# Altium schematic sheet 练习4原理图.SchDoc
size A3
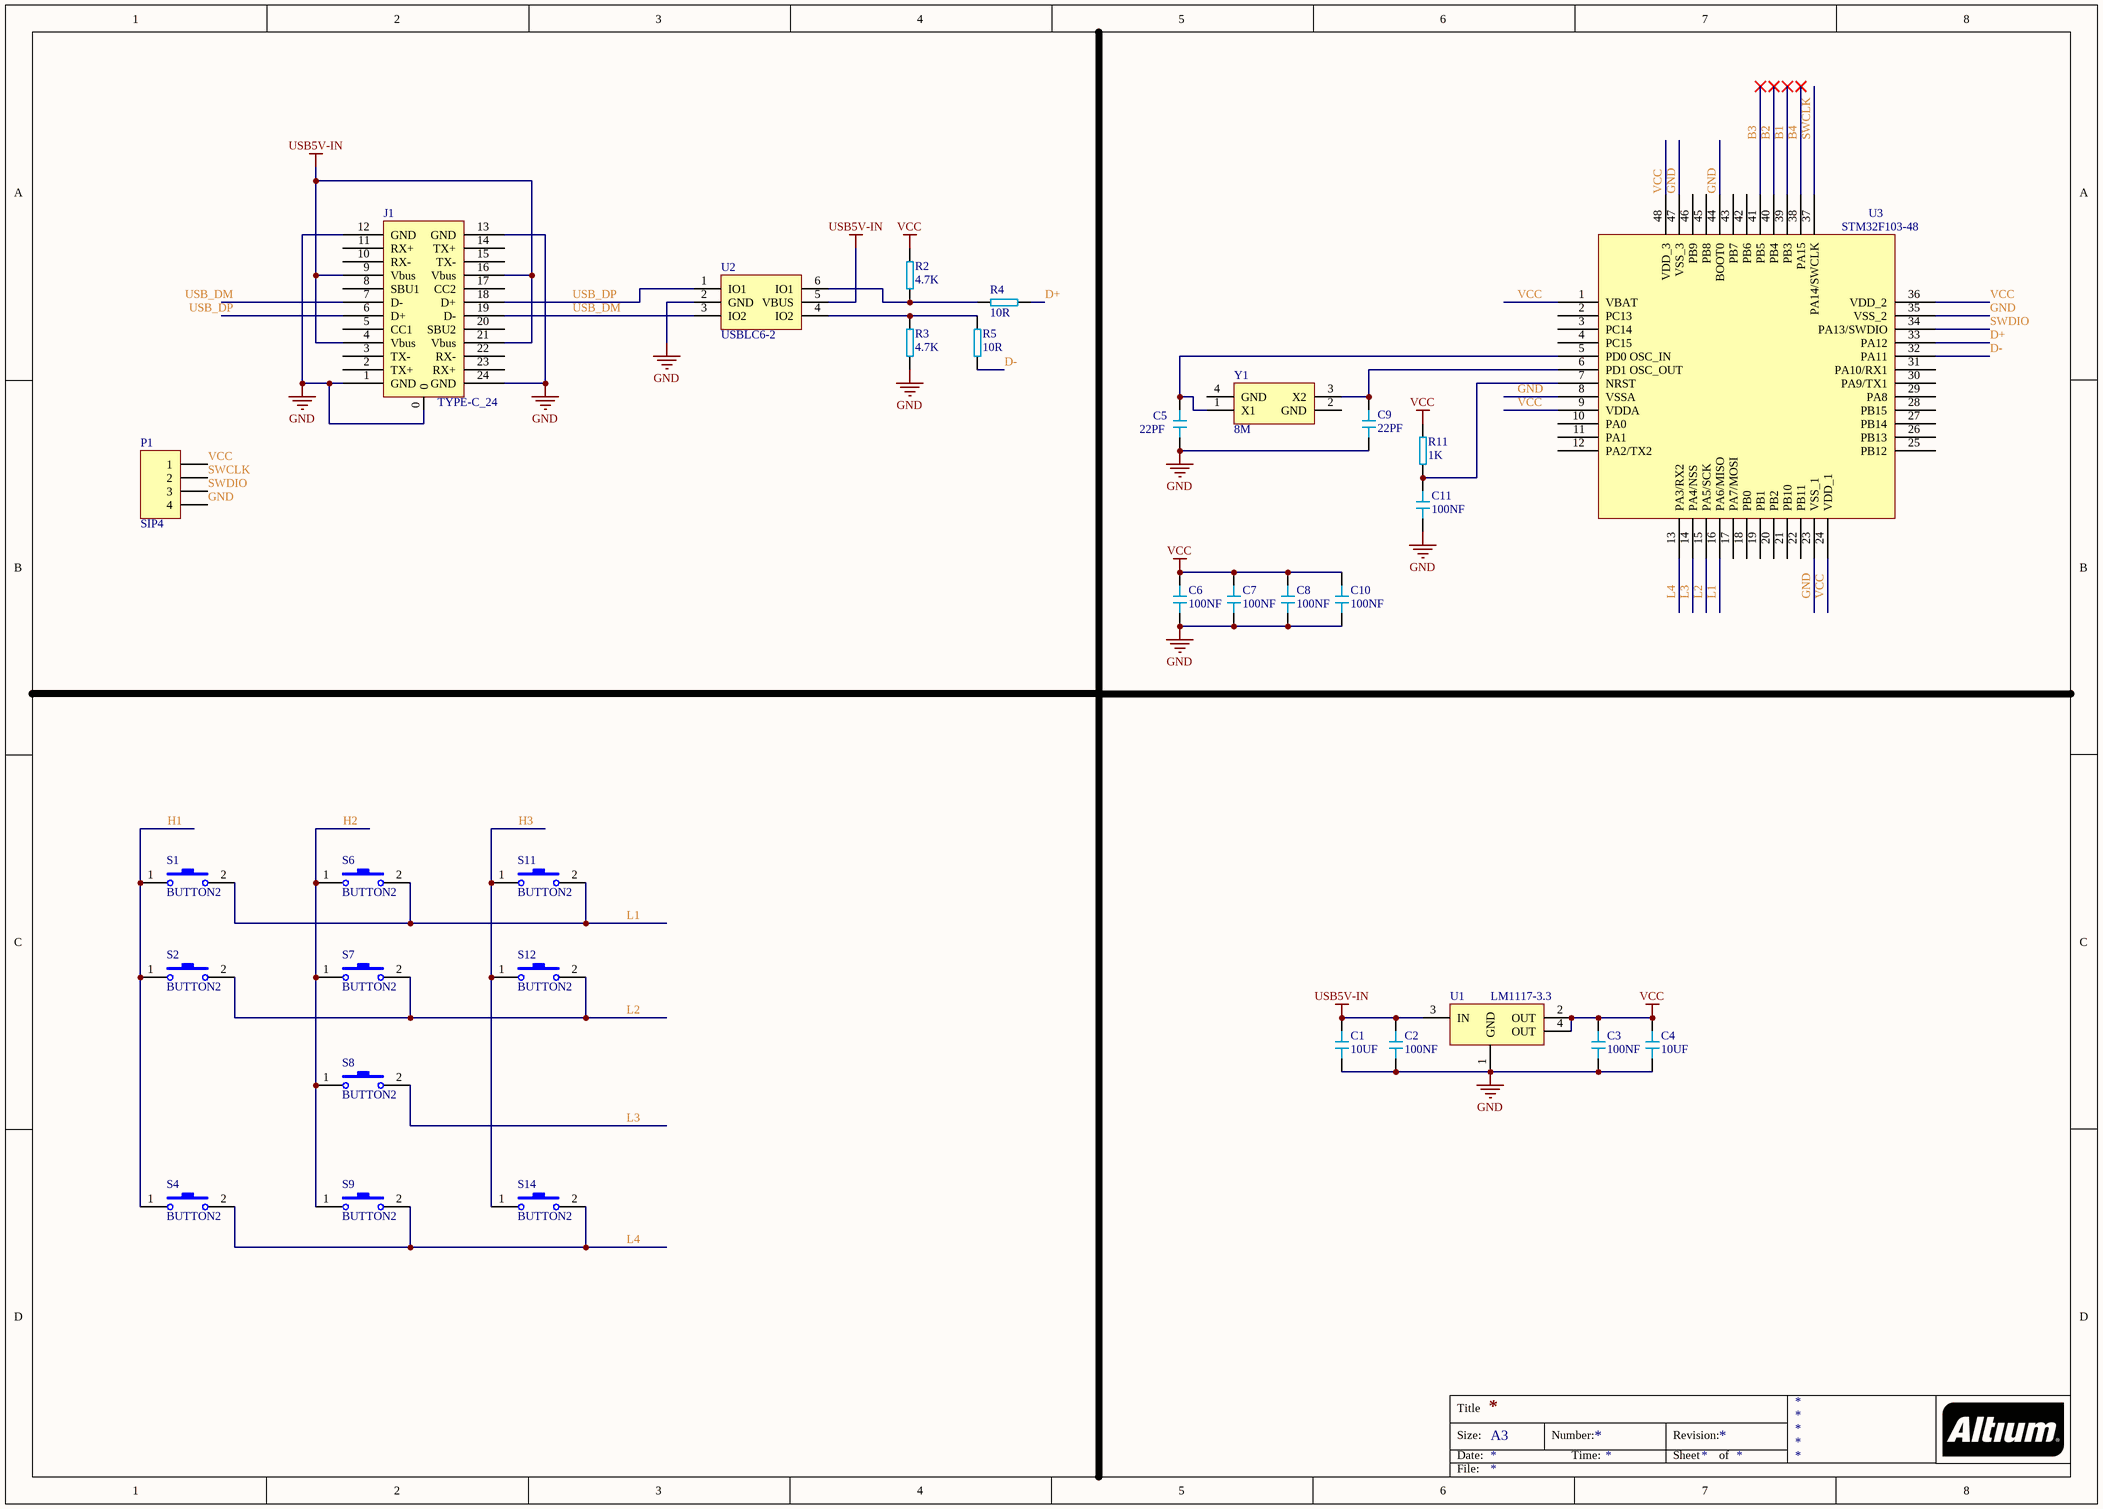
[diagram p0: 练习4原理图.SchDoc]

## Parts
C1  10UF  [C0603]
C2  100NF  [C0603]
C3  100NF  [C0603]
C4  10UF  [C0603]
C5  22PF  [C0603]
C6  100NF  [C0603]
C7  100NF  [C0603]
C8  100NF  [C0603]
C9  22PF  [C0603]
C10  100NF  [C0603]
C11  100NF  [C0603]
J1  TYPE-C_24  [TYPE-C24P]
P1  SIP4  [SIP4]
R2  4.7K  [R0603]
R3  4.7K  [R0603]
R4  10R  [R0603]
R5  10R  [R0603]
R11  1K  [R0603]
S1  BUTTON2  [KEY]
S2  BUTTON2  [KEY]
S4  BUTTON2  [KEY]
S6  BUTTON2  [KEY]
S7  BUTTON2  [KEY]
S8  BUTTON2  [KEY]
S9  BUTTON2  [KEY]
S11  BUTTON2  [KEY]
S12  BUTTON2  [KEY]
S14  BUTTON2  [KEY]
U1  LM1117-3.3  [SOT223]
U2  USBLC6-2  [SOT23-6]
U3  STM32F103-48  [LQFP48]
Y1  8M  [XTAL-3225-4]

## Nets
GND: C1.1 C2.1 C3.1 C4.1 C5.1 C6.1 C7.1 C8.1 C9.1 C10.1 C11.1 J1.0 J1.1(GND) J1.12(GND) J1.13(GND) J1.24(GND) P1.4 R3.1 U1.1(GND) U2.2(GND) U3.8(VSSA) U3.23(VSS_1) U3.35(VSS_2) U3.44(BOOT0) U3.47(VSS_3)
USB5V-IN: C1.2 C2.2 J1.4(Vbus) J1.9(Vbus) J1.16(Vbus) J1.21(Vbus) U1.3(IN) U2.5(VBUS)
VCC: C3.2 C4.2 C6.2 C7.2 C8.2 C10.2 P1.1 R2.2 R11.2 U1.2(OUT) U1.4(OUT) U3.1(VBAT) U3.9(VDDA) U3.24(VDD_1) U3.36(VDD_2) U3.48(VDD_3)
B1: U3.39(PB3)
B2: U3.40(PB4)
B3: U3.41(PB5)
B4: U3.38(PA15)
D+: R4.2 U3.33(PA12)
D-: R5.1 U3.32(PA11)
H1: S1.1 S2.1 S4.1
H2: S6.1 S7.1 S8.1 S9.1
H3: S11.1 S12.1 S14.1
L1: S1.2 S6.2 S11.2 U3.16(PA6/MISO)
L2: S2.2 S7.2 S12.2 U3.15(PA5/SCK)
L3: S8.2 U3.14(PA4/NSS)
L4: S4.2 S9.2 S14.2 U3.13(PA3/RX2)
SWCLK: P1.2 U3.37(PA14/SWCLK)
SWDIO: P1.3 U3.34(PA13/SWDIO)
USB_DM: J1.7(D-) J1.19(D-) U2.3(IO2)
USB_DP: J1.6(D+) J1.18(D+) U2.1(IO1)
NetC5_2: C5.2 U3.5(PD0_OSC_IN) Y1.1(X1)
NetC9_2: C9.2 U3.6(PD1_OSC_OUT) Y1.3(X2)
NetC11_2: C11.2 R11.1 U3.7(NRST)
NetR2_1: R2.1 R4.1 U2.6(IO1)
NetR3_2: R3.2 R5.2 U2.4(IO2)

Not connected (* = marked no-connect by the designer): J1 2(TX+) 3(TX-) 5(CC1) 8(SBU1) 10(RX-) 11(RX+) 14(TX+) 15(TX-) 17(CC2) 20(SBU2) 22(RX-) 23(RX+); U3 2(PC13) 3(PC14) 4(PC15) 10(PA0) 11(PA1) 12(PA2/TX2) 17(PA7/MOSI) 18(PB0) 19(PB1) 20(PB2) 21(PB10) 22(PB11) 25(PB12) 26(PB13) 27(PB14) 28(PB15) 29(PA8) 30(PA9/TX1) 31(PA10/RX1) 42(PB6) 43(PB7) 45(PB8) 46(PB9); Y1 2(GND) 4(GND)

## Notes on the sheet
- Title
- Size:
- Date:
- A3
- Number:
- Time:
- Revision:
- Sheet
- of
- File:

## Library data of the parts
C1-C11 = C0603: 贴片电容
P1 = SIP4: 连接器; LatestRevisionDate: 17-Jul-2002; LatestRevisionNote: Re-released for DXP Platform.; Publisher: Altium Limited
R2-R5 R11 = R-0603: 贴片电阻
S1 S2 S4 S6-S9 S11 S12 S14 = BUTTON2: 按钮; Published: 24-Mar-1999; LatestRevisionDate: 17-Jul-2002; LatestRevisionNote: Re-released for DXP Platform.; PackageReference: SPST-2; Publisher: Altium Limited; PackageDescription: Switch; 2 Leads
U1 = 1117: 芯片; LatestRevisionDate: 17-Jul-2002; LatestRevisionNote: Re-released for DXP Platform.; Publisher: Altium Limited
Y1 = XTAL-4-W: 无源晶振; Published: 8-Jun-2000; LatestRevisionDate: 17-Jul-2002; LatestRevisionNote: Re-released for DXP Platform.; PackageReference: R38; Publisher: Altium Limited; PackageDescription: Crystal, Thru-Hole; 2 Leads; Body 3.1 x 8.2 mm (Dia.xH)